# Altium schematic sheet SoilMoistureSensorv2.SchDoc: Soil Moisture Sensor
size 431 x 279 mm; Date: 5/9/22; Author: Christian Martinez; CompanyName: UW-Madison; SheetNumber: 1; SheetTotal: 1; ENG_APP_DATE: --/--/--; DSN_APP_DATE: --/--/--; CHK_APP_DATE: --/--/--; SPICEModelCacheUKPNWDHY: <root> / <DocumentId>UKPNWDHY</DocumentId> / </root>
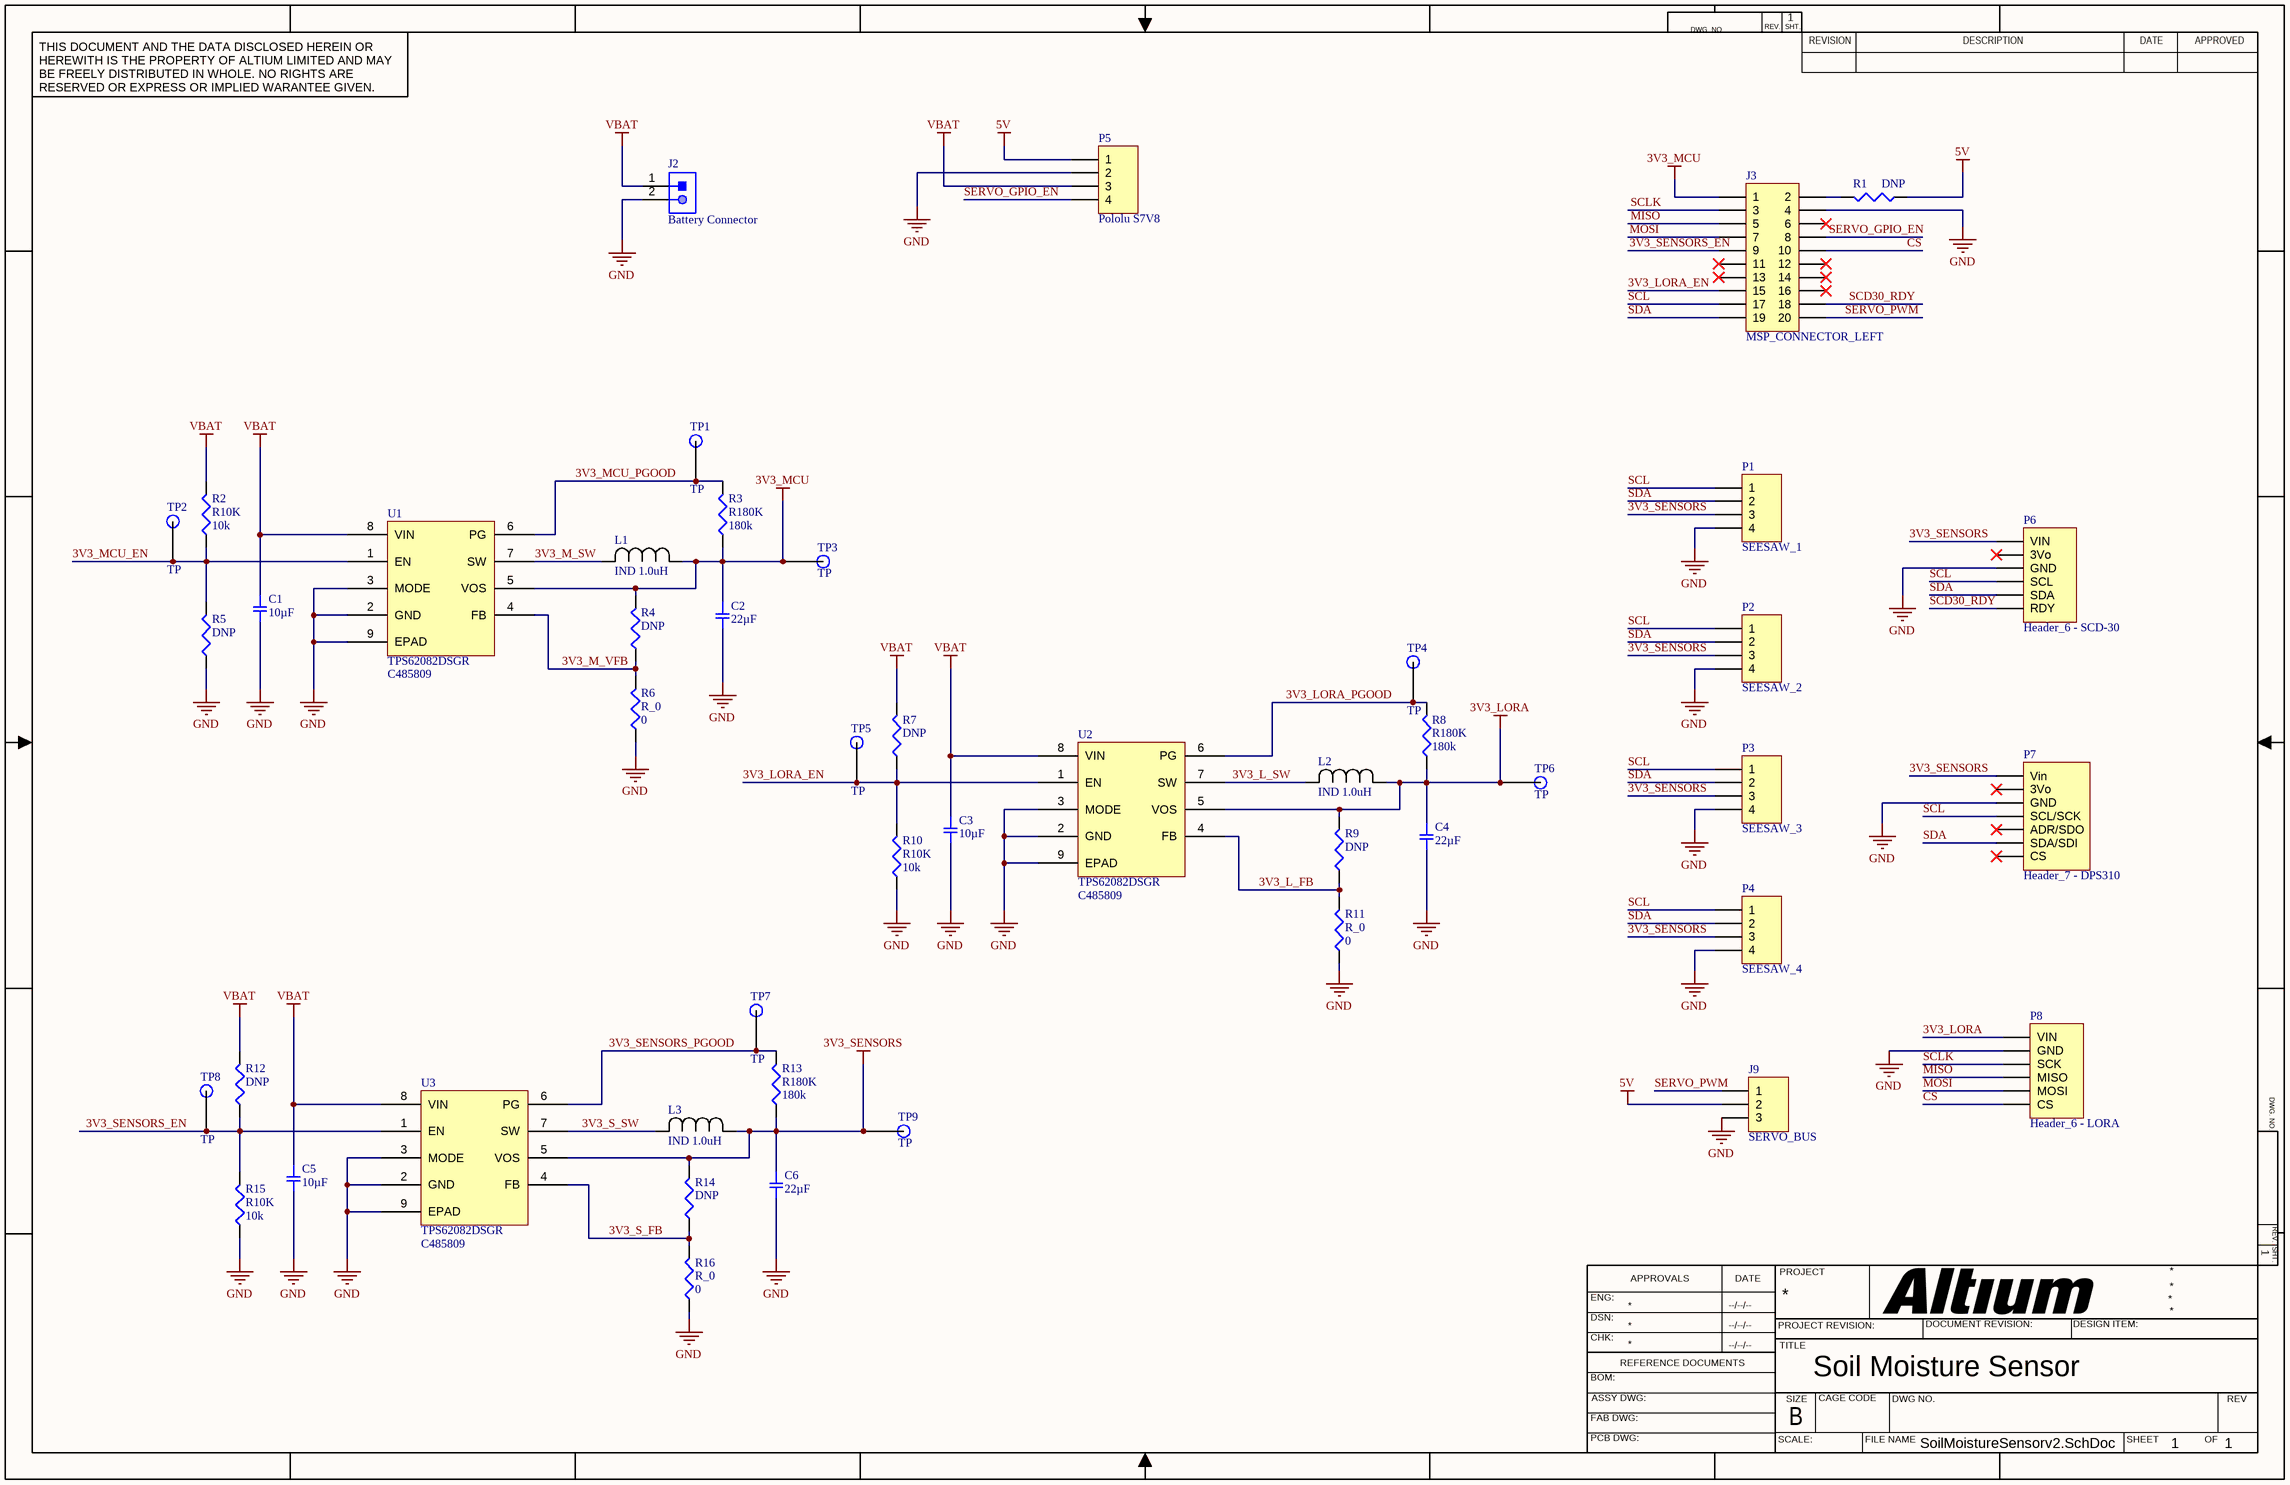
[diagram p0: SoilMoistureSensorv2.SchDoc]

## Parts
C1  10µF  [SMD-0805C]
C2  22µF  [SMD-0805C]
C3  10µF  [SMD-0805C]
C4  22µF  [SMD-0805C]
C5  10µF  [SMD-0805C]
C6  22µF  [SMD-0805C]
J2  Battery Connector  [JST-S2B-PH-K-S_V]
J3  MSP_CONNECTOR_LEFT  [HDR2X10]
J9  SERVO_BUS  [HDR1X3]
L1  IND 1.0uH  [INDP4340X15N]
L2  IND 1.0uH  [INDP4340X15N]
L3  IND 1.0uH  [INDP4340X15N]
P1  SEESAW_1  [Pin Header 1x4 TH Pitch 2.54mm]
P2  SEESAW_2  [Pin Header 1x4 TH Pitch 2.54mm]
P3  SEESAW_3  [Pin Header 1x4 TH Pitch 2.54mm]
P4  SEESAW_4  [Pin Header 1x4 TH Pitch 2.54mm]
P5  Pololu S7V8  [Pin Header S7V8]
P6  Header_6 - SCD-30  [Pin Header SCD-30]
P7  Header_7 - DPS310  [Pin Header DPS310]
P8  Header_6 - LORA  [Pin Header LORA]
R1  DNP  [J1-0603]
R2  R10K  value 10k  [J1-0603]
R3  R180K  value 180k  [J1-0603]
R4  DNP  [J1-0603]
R5  DNP  [J1-0603]
R6  R_0  value 0  [J1-0603]
R7  DNP  [J1-0603]
R8  R180K  value 180k  [J1-0603]
R9  DNP  [J1-0603]
R10  R10K  value 10k  [J1-0603]
R11  R_0  value 0  [J1-0603]
R12  DNP  [J1-0603]
R13  R180K  value 180k  [J1-0603]
R14  DNP  [J1-0603]
R15  R10K  value 10k  [J1-0603]
R16  R_0  value 0  [J1-0603]
TP1  TP  [Test Point]
TP2  TP  [Test Point]
TP3  TP  [Test Point]
TP4  TP  [Test Point]
TP5  TP  [Test Point]
TP6  TP  [Test Point]
TP7  TP  [Test Point]
TP8  TP  [Test Point]
TP9  TP  [Test Point]
U1  TPS62082DSGR  LCSC Part #: C485809  [DSG8_1P6X0P9]
U2  TPS62082DSGR  LCSC Part #: C485809  [DSG8_1P6X0P9]
U3  TPS62082DSGR  LCSC Part #: C485809  [DSG8_1P6X0P9]

## Nets
3V3_LORA: C4.1 L2.1 P8.1(VIN) R8.1 R9.2 TP6.1 U2.5(VOS)
3V3_MCU: C2.1 J3.1 L1.1 R3.1 R4.2 TP3.1 U1.5(VOS)
3V3_SENSORS: C6.1 L3.1 P1.3 P2.3 P3.3 P4.3 P6.1(VIN) P7.1(Vin) R13.1 R14.2 TP9.1 U3.5(VOS)
5V: J9.2 P5.1 R1.1
GND: C1.2 C2.2 C3.2 C4.2 C5.2 C6.2 J2.2 J3.4 J9.3 P1.4 P2.4 P3.4 P4.4 P5.2 P6.3(GND) P7.3(GND) P8.2(GND) R5.1 R6.1 R10.1 R11.1 R15.1 R16.1 U1.2(GND) U1.3(MODE) U1.9(EPAD) U2.2(GND) U2.3(MODE) U2.9(EPAD) U3.2(GND) U3.3(MODE) U3.9(EPAD)
VBAT: C1.1 C3.1 C5.1 J2.1 P5.3 R2.2 R7.2 R12.2 U1.8(VIN) U2.8(VIN) U3.8(VIN)
3V3_L_FB: R9.1 R11.2 U2.4(FB)
3V3_L_SW: L2.2 U2.7(SW)
3V3_LORA_EN: J3.15 R7.1 R10.2 TP5.1 U2.1(EN)
3V3_LORA_PGOOD: R8.2 TP4.1 U2.6(PG)
3V3_M_SW: L1.2 U1.7(SW)
3V3_M_VFB: R4.1 R6.2 U1.4(FB)
3V3_MCU_EN: R2.1 R5.2 TP2.1 U1.1(EN)
3V3_MCU_PGOOD: R3.2 TP1.1 U1.6(PG)
3V3_S_FB: R14.1 R16.2 U3.4(FB)
3V3_S_SW: L3.2 U3.7(SW)
3V3_SENSORS_EN: J3.9 R12.1 R15.2 TP8.1 U3.1(EN)
3V3_SENSORS_PGOOD: R13.2 TP7.1 U3.6(PG)
CS: J3.10 P8.6(CS)
MISO: J3.5 P8.4(MISO)
MOSI: J3.7 P8.5(MOSI)
SCD30_RDY: J3.18 P6.6(RDY)
SCL: J3.17 P1.1 P2.1 P3.1 P4.1 P6.4(SCL) P7.4(SCL/SCK)
SCLK: J3.3 P8.3(SCK)
SDA: J3.19 P1.2 P2.2 P3.2 P4.2 P6.5(SDA) P7.6(SDA/SDI)
SERVO_GPIO_EN: J3.8 P5.4
SERVO_PWM: J3.20 J9.1
NetJ3_2: J3.2 R1.2

Not connected (* = marked no-connect by the designer): J3 6* 11* 12* 13* 14* 16*; P6 2(3Vo)*; P7 2(3Vo)* 5(ADR/SDO)* 7(CS)*

## Notes on the sheet
- DWG. NO.
- REV.
- SHT.
- THIS DOCUMENT AND THE DATA DISCLOSED HEREIN OR HEREWITH IS THE PROPERTY OF ALTIUM LIMITED AND MAY BE FREELY DISTRIBUTED IN WHOLE. NO RIGHTS ARE RESERVED OR EXPRESS OR IMPLIED WARANTEE GIVEN.
- REVISION
- DESCRIPTION
- DATE
- APPROVED
- ENG:
- APPROVALS
- PROJECT
- DSN:
- CHK:
- REFERENCE DOCUMENTS
- PROJECT REVISION:
- TITLE
- DOCUMENT REVISION:
- DESIGN ITEM:
- BOM:
- FAB DWG:
- PCB DWG:
- ASSY DWG:
- SCALE:
- SIZE
- B
- CAGE CODE
- FILE NAME
- DWG NO.
- SHEET
- OF
- REV

## Library data of the parts
C1 C3 C5 = GCJ21BR71A106KE01L: CAP CER 10UF 10V X7R 0805; Manufacturer: Murata Electronics North America; Factory Stock: 0; Unit Price (USD): 0.56; Minimum Quantity: 1; Tolerance: ±10%; Datasheets: http://www.murata.com/~/media/webrenewal/support/library/catalog/products/capacitor/mlcc/c03e.ashx; Image: //media.digikey.com/Renders/Murata%20Renders/0805%20(2012%20Metric)%20.85mm.jpg; Digikey P/N: 490-12646-1-ND; Part Number: GCJ21BR71A106KE01L; Quantity Available: 2702; @ qty: 0; Packaging: Cut Tape (CT); Series: GCJ; Part Status: Active; Value: 10µF; Voltage: 10V; Temperature Coefficient: X7R; Operating Temperature: -55°C ~ 125°C; Features: Soft Termination; Ratings: AEC-Q200; Applications: Automotive, Boardflex Sensitive; Mounting Type: Surface Mount, MLCC; Package / Case: 0805 (2012 Metric); Size / Dimension: 0.079" L x 0.049" W (2.00mm x 1.25mm); Height - Seated (Max): -; Thickness (Max): 0.057" (1.45mm); Lead Spacing: -; LCSC Part #: C440198
C2 C4 C6 = GRT21BR61A226ME13L: CAP CER 22UF 10V X5R 0805; Manufacturer: Murata Electronics North America; Factory Stock: 0; Unit Price (USD): 0.58; Minimum Quantity: 1; Tolerance: ±20%; Datasheets: http://search.murata.co.jp/Ceramy/image/img/A01X/G101/ENG/GRT21BR61A226ME13-01.pdf; Image: //media.digikey.com/Renders/Murata%20Renders/GRT%20Series%200805(2012%20Metric).jpg; Digikey P/N: 490-12374-1-ND; Part Number: GRT21BR61A226ME13L; Quantity Available: 9088; @ qty: 0; Packaging: Cut Tape (CT); Series: GRT; Part Status: Active; Value: 22µF; Voltage: 10V; Temperature Coefficient: X5R; Operating Temperature: -55°C ~ 85°C; Features: Derating Recommended; Ratings: AEC-Q200; Applications: Automotive; Mounting Type: Surface Mount, MLCC; Package / Case: 0805 (2012 Metric); Size / Dimension: 0.079" L x 0.049" W (2.00mm x 1.25mm); Height - Seated (Max): -; Thickness (Max): 0.057" (1.45mm); Lead Spacing: -; Lead Style: -; LCSC Part #: C45783
J2 = CMP-002-00030-2: Male Header, Pitch 2 mm, 1 x 2 Position, Height 4.8 mm, Tail Length 3.4 mm, -25 to 85 degC, RoHS, Bulk; Manufacturer: Japan Solderless Terminals; Package Reference: S2B-PH-K-S; Case/Package: S2B-PH-K-S; Datasheet URL: http://www.jst-mfg.com/product/pdf/eng/ePH.pdf; RoHS Compliant: Unknown; Datasheet Version: Dec-12; Gender: Male; Min Operating Temperature: -25°C; Max Operating Temperature: 85°C; Package Description: Male Header, Pitch 2 mm, 1 x 2 Position, Height 4.8 mm, Tail Length 3.4 mm; Connector Type: Header; Mounting Technology: SM
J3 = Header 10X2: Header, 10-Pin, Dual row; LatestRevisionDate: 17-Jul-2002; LatestRevisionNote: Re-released for DXP Platform.; Publisher: Altium Limited
J9 = Header 3: Header, 3-Pin; LatestRevisionDate: 17-Jul-2002; LatestRevisionNote: Re-released for DXP Platform.; Publisher: Altium Limited
L1-L3 = IND 1.0uH: SLO0415S1R0MTT; Manufacturer_Part_Number: XFL5030-102ME; Vendor: CoilCraft; Type: DEV; Tolerance: +-20%; Maximum DC Current: 28A; Inductance: 1uH; Qualification: AEC-Q200; RefDes: RefDes; Value: 1.0uH; Do Not Populate: *; Temperature: -40C ~ 125C; Package / Case: 5.48mm x 5.28mm x 3.1mm; Height: 3.1mm; Link: https://www.mouser.com/ProductDetail/Coilcraft/XFL5030-102MEB?qs=sGAEpiMZZMsg%252by3WlYCkUy0Se8nYOmwuY%252bO5URw9yeY%3d; Datasheet: https://www.mouser.com/datasheet/2/597/xfl5030-1223909.pdf; LCSC Part #: C325988
P1-P4 = Header 4: Header, 4-Pin; LatestRevisionDate: 17-Jul-2002; LatestRevisionNote: Re-released for DXP Platform.; Publisher: Altium Limited
P5 = Pololu S7V8: Header, 4-Pin; LatestRevisionDate: 17-Jul-2002; LatestRevisionNote: Re-released for DXP Platform.; Publisher: Altium Limited
P6 = Header_6 - SCD-30: Header, 6-Pin; LatestRevisionDate: 17-Jul-2002; LatestRevisionNote: Re-released for DXP Platform.; Publisher: Altium Limited
P7 = Header_7 - DPS310: Header, 7-Pin; LatestRevisionDate: 17-Jul-2002; LatestRevisionNote: Re-released for DXP Platform.; Publisher: Altium Limited
P8 = Header_6 - LORA: Header, 6-Pin; LatestRevisionDate: 17-Jul-2002; LatestRevisionNote: Re-released for DXP Platform.; Publisher: Altium Limited
R1 = Res3: Resistor; Value: 0; Published: 8-Jun-2000; LatestRevisionDate: 29-May-2009; LatestRevisionNote: IPC-7351 Footprint Added.; PackageReference: J1-0603; Publisher: Altium Limited; PackageDescription: Chip Resistor
R2 R3 R6 R8 R10 R11 R13 R15 R16 = Res3: Resistor; Published: 8-Jun-2000; LatestRevisionDate: 29-May-2009; LatestRevisionNote: IPC-7351 Footprint Added.; PackageReference: J1-0603; Publisher: Altium Limited; PackageDescription: Chip Resistor
  R2 R10 R15: LCSC Part #: C25804
  R3 R8 R13: LCSC Part #: C22827
  R6 R11 R16: LCSC Part #: C21189
R4 R5 R9 R12 R14 = Res3: Resistor; Value: 123; Published: 8-Jun-2000; LatestRevisionDate: 29-May-2009; LatestRevisionNote: IPC-7351 Footprint Added.; PackageReference: J1-0603; Publisher: Altium Limited; PackageDescription: Chip Resistor
R7 = Res3: Resistor; Value: 1K; Published: 8-Jun-2000; LatestRevisionDate: 29-May-2009; LatestRevisionNote: IPC-7351 Footprint Added.; PackageReference: J1-0603; Publisher: Altium Limited; PackageDescription: Chip Resistor
TP1-TP9 = TP: SMD TEST POINT